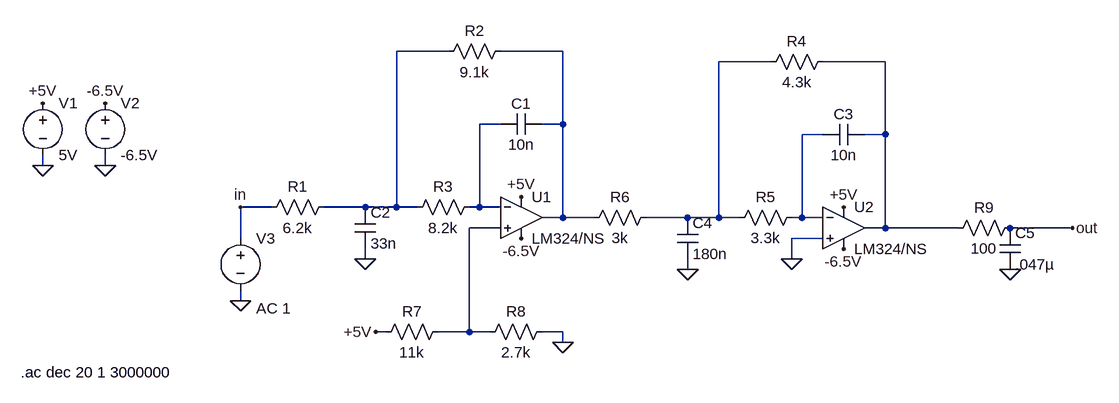
[diagram p0: schematic MFB_Bode_Sim_2_stage.asc]
MFB_Bode_Sim_2_stage.asc, the LTspice schematic file:
Version 4
SHEET 1 2296 768
WIRE 288 -32 208 -32
WIRE 464 -32 368 -32
WIRE 784 -16 704 -16
WIRE 960 -16 864 -16
WIRE 368 80 336 80
WIRE 464 80 464 -32
WIRE 464 80 432 80
WIRE 864 96 832 96
WIRE 960 96 960 -16
WIRE 960 96 928 96
WIRE -336 144 -336 128
WIRE -240 144 -240 128
WIRE 16 208 -32 208
WIRE 160 208 96 208
WIRE 208 208 208 -32
WIRE 208 208 160 208
WIRE 240 208 208 208
WIRE 336 208 336 80
WIRE 336 208 320 208
WIRE 368 208 336 208
WIRE 464 224 464 80
WIRE 464 224 432 224
WIRE 512 224 464 224
WIRE 656 224 592 224
WIRE 704 224 704 -16
WIRE 704 224 656 224
WIRE 736 224 704 224
WIRE 832 224 832 96
WIRE 832 224 816 224
WIRE 864 224 832 224
WIRE 368 240 320 240
WIRE 960 240 960 96
WIRE 960 240 928 240
WIRE 1072 240 960 240
WIRE 1248 240 1152 240
WIRE -32 256 -32 208
WIRE 864 256 816 256
WIRE 160 288 160 272
WIRE 816 288 816 256
WIRE 656 304 656 288
WIRE -32 352 -32 336
WIRE 192 400 176 400
WIRE 320 400 320 240
WIRE 320 400 272 400
WIRE 352 400 320 400
WIRE 464 400 432 400
WIRE 464 416 464 400
FLAG -240 144 0
FLAG -336 144 0
FLAG -336 48 +5V
FLAG 400 192 +5V
FLAG -240 48 -6.5V
FLAG 400 256 -6.5V
FLAG 160 288 0
FLAG -32 352 0
FLAG -32 208 in
FLAG 896 208 +5V
FLAG 896 272 -6.5V
FLAG 656 304 0
FLAG 1248 240 out
FLAG 816 288 0
FLAG 176 400 +5V
FLAG 464 416 0
FLAG 1152 304 0
SYMBOL ZZZ\\OpAmp\\LM324 400 224 R0
SYMATTR InstName U1
SYMBOL voltage -336 32 R0
WINDOW 123 0 0 Left 0
WINDOW 39 0 0 Left 0
SYMATTR InstName V1
SYMATTR Value 5V
SYMBOL voltage -240 32 R0
WINDOW 123 0 0 Left 0
WINDOW 39 0 0 Left 0
SYMATTR InstName V2
SYMATTR Value -6.5V
SYMBOL cap 432 64 R90
WINDOW 0 0 32 VBottom 2
WINDOW 3 32 32 VTop 2
SYMATTR InstName C1
SYMATTR Value 10n
SYMBOL res 384 -48 R90
WINDOW 0 0 56 VBottom 2
WINDOW 3 32 56 VTop 2
SYMATTR InstName R2
SYMATTR Value 9.1k
SYMBOL res 336 192 R90
WINDOW 0 0 56 VBottom 2
WINDOW 3 32 56 VTop 2
SYMATTR InstName R3
SYMATTR Value 8.2k
SYMBOL cap 144 208 R0
SYMATTR InstName C2
SYMATTR Value 33n
SYMBOL res 0 224 R270
WINDOW 0 32 56 VTop 2
WINDOW 3 0 56 VBottom 2
SYMATTR InstName R1
SYMATTR Value 6.2k
SYMBOL voltage -32 240 R0
WINDOW 3 -190 240 Left 2
WINDOW 123 24 124 Left 2
WINDOW 39 0 0 Left 0
SYMATTR Value ""
SYMATTR Value2 AC 1
SYMATTR InstName V3
SYMBOL ZZZ\\OpAmp\\LM324 896 240 R0
SYMATTR InstName U2
SYMBOL cap 928 80 R90
WINDOW 0 0 32 VBottom 2
WINDOW 3 32 32 VTop 2
SYMATTR InstName C3
SYMATTR Value 10n
SYMBOL res 880 -32 R90
WINDOW 0 0 56 VBottom 2
WINDOW 3 32 56 VTop 2
SYMATTR InstName R4
SYMATTR Value 4.3k
SYMBOL res 832 208 R90
WINDOW 0 0 56 VBottom 2
WINDOW 3 32 56 VTop 2
SYMATTR InstName R5
SYMATTR Value 3.3k
SYMBOL cap 640 224 R0
SYMATTR InstName C4
SYMATTR Value 180n
SYMBOL res 496 240 R270
WINDOW 0 32 56 VTop 2
WINDOW 3 0 56 VBottom 2
SYMATTR InstName R6
SYMATTR Value 3k
SYMBOL res 288 384 R90
WINDOW 0 0 56 VBottom 2
WINDOW 3 32 56 VTop 2
SYMATTR InstName R7
SYMATTR Value 11k
SYMBOL res 448 384 R90
WINDOW 0 0 56 VBottom 2
WINDOW 3 32 56 VTop 2
SYMATTR InstName R8
SYMATTR Value 2.7k
SYMBOL res 1168 224 R90
WINDOW 0 0 56 VBottom 2
WINDOW 3 32 56 VTop 2
SYMATTR InstName R9
SYMATTR Value 100
SYMBOL cap 1136 240 R0
SYMATTR InstName C5
SYMATTR Value .047µ
TEXT -370 462 Left 2 !.ac dec 20 1 3000000

The netlist it stands for:
* MFB_Bode_Sim_2_stage.asc
XU1 N007 N005 +5V -6.5V N002 LM324/NS  ; pins In+ In- V+ V- OUT
V1 +5V 0 5V
V2 -6.5V 0 -6.5V
C1 N002 N005 10n
R2 N002 N001 9.1k
R3 N005 N001 8.2k
C2 N001 0 33n
R1 in N001 6.2k
V3 in 0 AC 1
XU2 0 N006 +5V -6.5V N004 LM324/NS  ; pins In+ In- V+ V- OUT
C3 N004 N006 10n
R4 N004 N003 4.3k
R5 N006 N003 3.3k
C4 N003 0 180n
R6 N002 N003 3k
R7 N007 +5V 11k
R8 0 N007 2.7k
R9 out N004 100
C5 out 0 .047µ
.ac dec 20 1 3000000
.backanno
.end